# EAGLE schematic esd_fall_project rev3 (EAGLE 9.6.2)
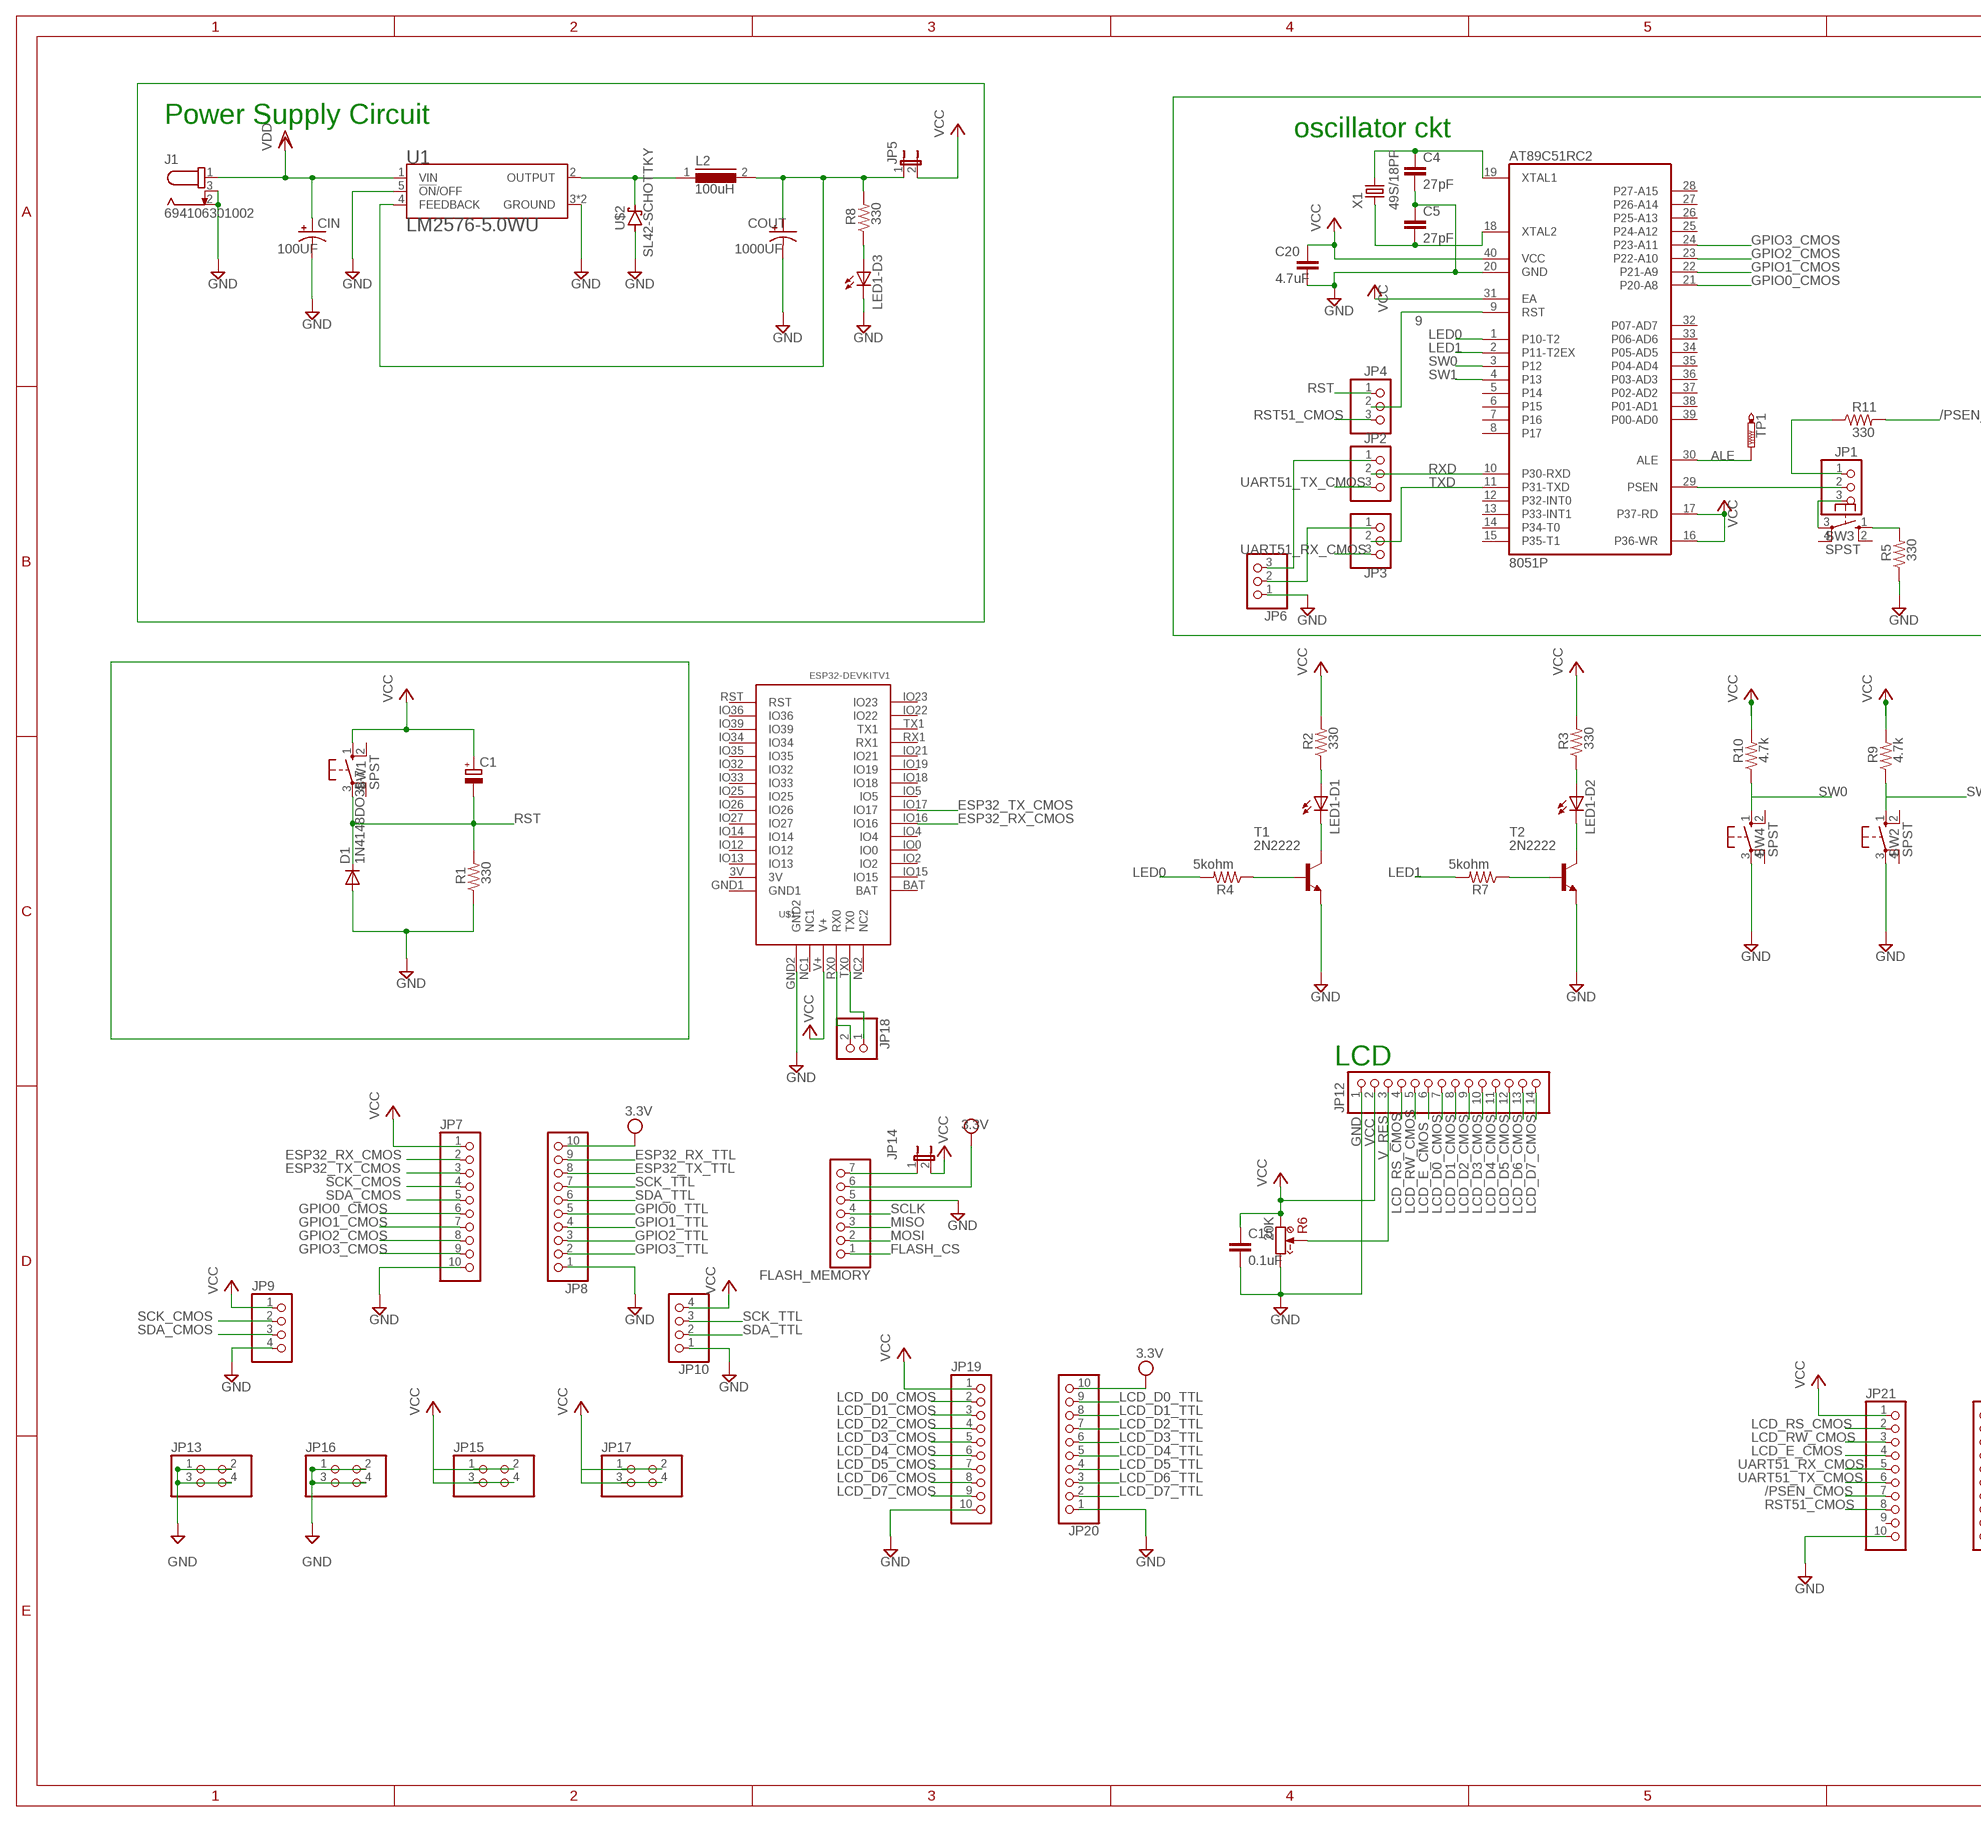
[diagram p0: schematic, sheet 1, part 1 of 2]
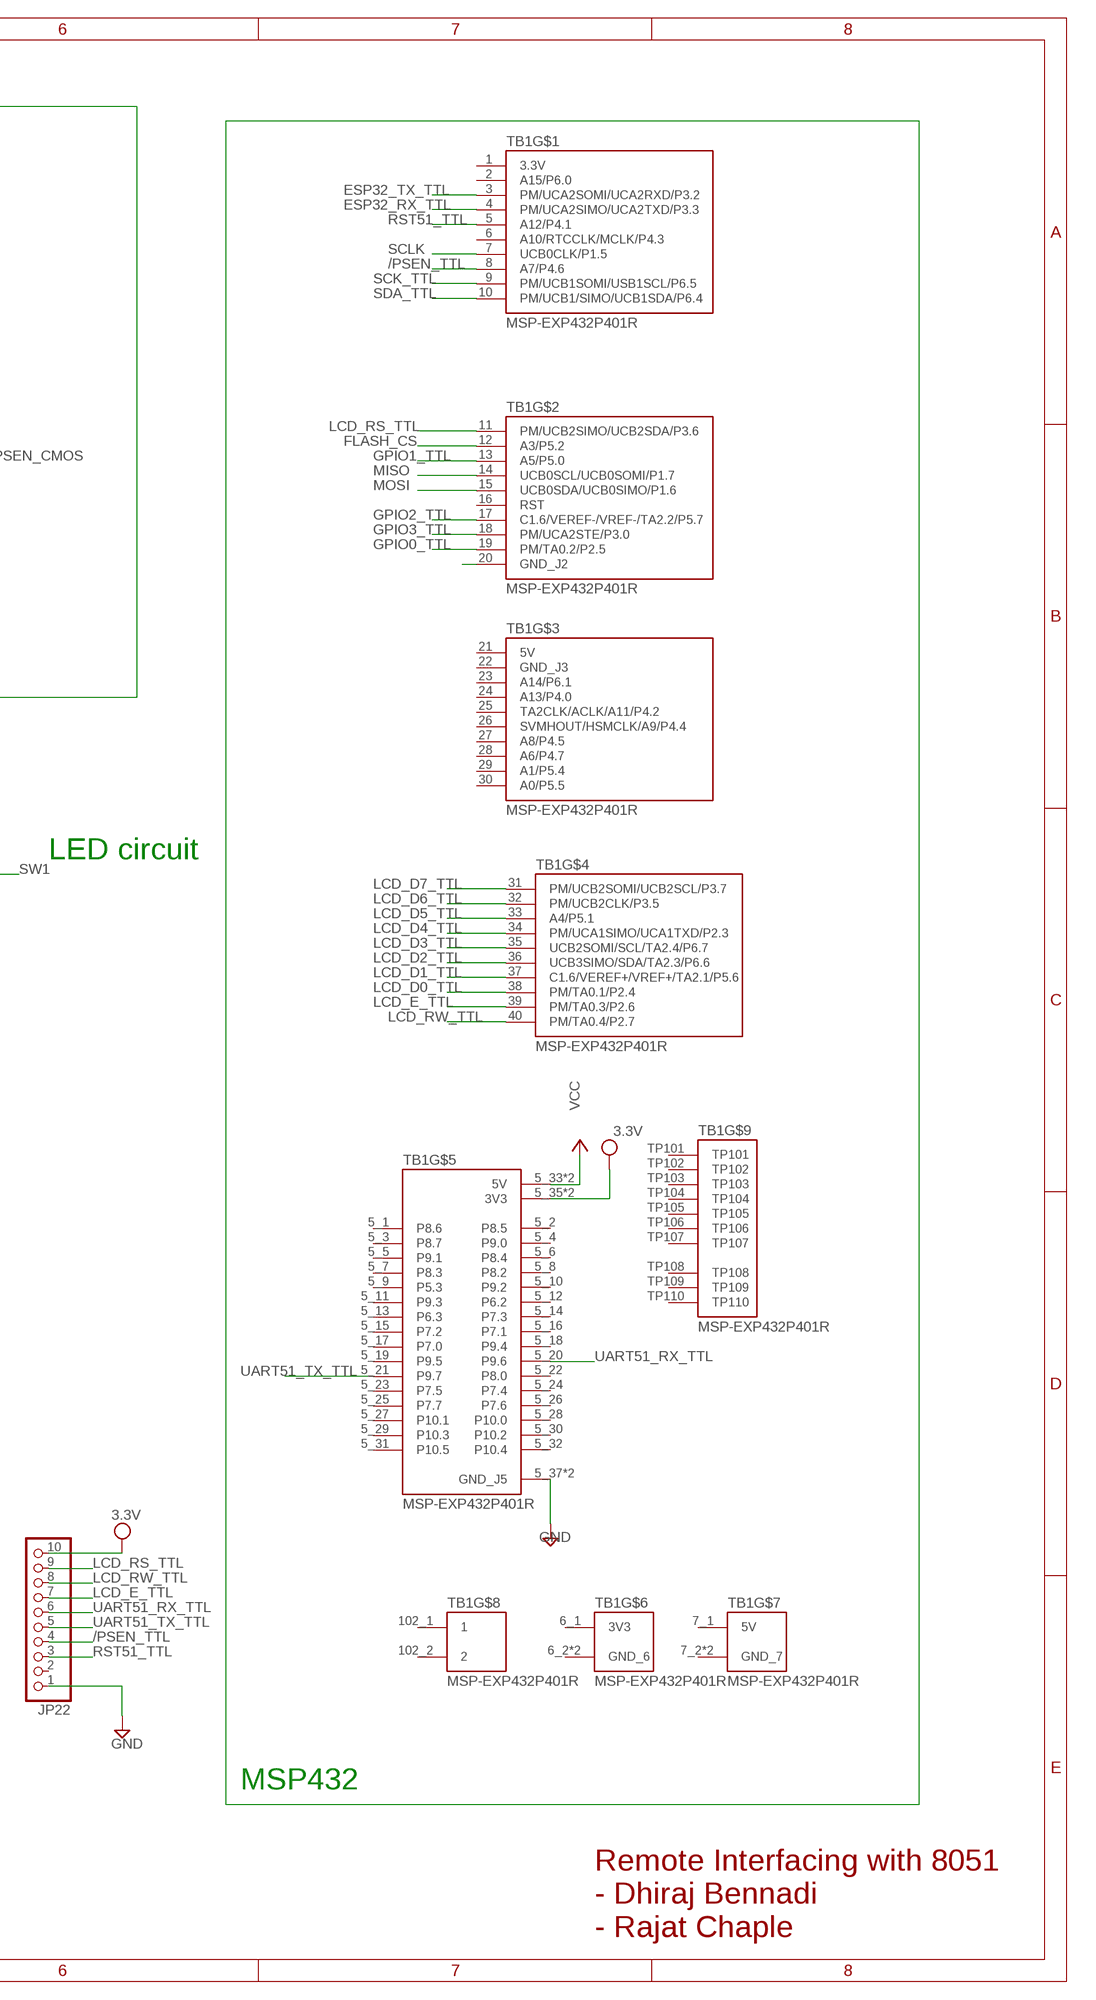
[diagram p1: schematic, sheet 1, part 2 of 2]

## Parts
AT89C51RC2  8051P  [DIL40]
C1  CPOL-EUE1.8-4  [E1,8-4]
C4  27pF  C2,5-3  [C2.5-3]
C5  27pF  C2,5-3  [C2.5-3]
C15  0.1uF  C2,5-3  [C2.5-3]
C20  4.7uF  C2,5-3  [C2.5-3]
CIN  100UF  [153CLV-1014]
COUT  1000UF  [150CLZ-1010]
D1  1N4148DO35-7  [DO35-7]
FLASH_MEMORY  PINHD-1X7  [1X07]
J1  694106301002  [694106301002]
JP1  PINHD-1X3  [1X03]
JP2  PINHD-1X3  [1X03]
JP3  PINHD-1X3  [1X03]
JP4  PINHD-1X3  [1X03]
JP5  JP1E  [JP1]
JP6  PINHD-1X3  [1X03]
JP7  PINHD-1X10  [1X10]
JP8  PINHD-1X10  [1X10]
JP9  PINHD-1X4  [1X04]
JP10  PINHD-1X4  [1X04]
JP12  PINHD-1X14  [1X14]
JP13  PINHD-2X2  [2X02]
JP14  JP1E  [JP1]
JP15  PINHD-2X2  [2X02]
JP16  PINHD-2X2  [2X02]
JP17  PINHD-2X2  [2X02]
JP18  PINHD-1X2  [1X02]
JP19  PINHD-1X10  [1X10]
JP20  PINHD-1X10  [1X10]
JP21  PINHD-1X10  [1X10]
JP22  PINHD-1X10  [1X10]
L2  100uH  DR127  [DR127]
LED1-D1  LED5MM  [LED5MM]
LED1-D2  LED5MM  [LED5MM]
LED1-D3  LED5MM  [LED5MM]
R1  330  R-US_0204/7  [0204/7]
R2  330  R-US_0204/7  [0204/7]
R3  330  R-US_0204/7  [0204/7]
R4  5kohm  R-US_0204/7  [0204/7]
R5  330  R-US_0204/7  [0204/7]
R6  20K  100K(64W/Y)  [64W]
R7  5kohm  R-US_0204/7  [0204/7]
R8  330  R-US_0204/7  [0204/7]
R9  4.7k  R-US_0204/7  [0204/7]
R10  4.7k  R-US_0204/7  [0204/7]
R11  330  R-US_0204/7  [0204/7]
SW1  SPST  10-XX  [B3F-10XX]
SW2  SPST  10-XX  [B3F-10XX]
SW3  SPST  10-XX  [B3F-10XX]
SW4  SPST  10-XX  [B3F-10XX]
T1  2N2222  [TO18]
T2  2N2222  [TO18]
TB1  MSP-EXP432P401R  [SHIELD_MSP-EXP432P401R]
TP1  PTR1B2,54  [B2,54]
U1  LM2576-5.0WU  [DPAK6P170_1524X459L254X81N]
U$1  ESP32DEVKITV1  [ESP32-DEVKITV1]
U$2  SL42-SCHOTTKY  [SMC]
X1  49S/18PF  [XTAL_HC49]

## Nets
3.3V: JP8.10 JP20.10 JP22.10
9: AT89C51RC2.9(RST) JP4.2
/PSEN_CMOS: JP21.7 R11.2
/PSEN_TTL: JP22.4 TB1.8(A7/P4.6)
ALE: AT89C51RC2.30(ALE) TP1.TP
ESP32_RX_CMOS: JP7.2 U$1.IO16
ESP32_RX_TTL: JP8.9 TB1.4(PM/UCA2SIMO/UCA2TXD/P3.3)
ESP32_TX_CMOS: JP7.3 U$1.IO17
ESP32_TX_TTL: JP8.8 TB1.3(PM/UCA2SOMI/UCA2RXD/P3.2)
FLASH_CS: FLASH_MEMORY.1 TB1.12(A3/P5.2)
GND: AT89C51RC2.20(GND) C4.2 C5.1 C15.2 C20.2 CIN.- COUT.- D1.A FLASH_MEMORY.5 J1.2 J1.3 JP6.1 JP7.10 JP8.1 JP9.4 JP10.1 JP12.1 JP13.1 JP13.2 JP13.3 JP13.4 JP16.1 JP16.2 JP16.3 JP16.4 JP19.10 JP20.1 JP21.10 JP22.1 LED1-D3.K(C) R1.1 R5.1 R6.3(CW) SW2.3(P) SW4.3(P) T1.1(E) T2.1(E) TB1.5_37(GND_J5) TB1.5_38(GND_J5) U1.3(GROUND) U1.5(!ON!/OFF) U1.6(GROUND) U$1.GND2 U$2.A
GPIO0_CMOS: AT89C51RC2.21(P20-A8) JP7.6
GPIO0_TTL: JP8.5 TB1.19(PM/TA0.2/P2.5)
GPIO1_CMOS: AT89C51RC2.22(P21-A9) JP7.7
GPIO1_TTL: JP8.4 TB1.13(A5/P5.0)
GPIO2_CMOS: AT89C51RC2.23(P22-A10) JP7.8
GPIO2_TTL: JP8.3 TB1.17(C1.6/VEREF-/VREF-/TA2.2/P5.7)
GPIO3_CMOS: AT89C51RC2.24(P23-A11) JP7.9
GPIO3_TTL: JP8.2 TB1.18(PM/UCA2STE/P3.0)
LCD_D0_CMOS: JP12.7 JP19.2
LCD_D0_TTL: JP20.9 TB1.38(PM/TA0.1/P2.4)
LCD_D1_CMOS: JP12.8 JP19.3
LCD_D1_TTL: JP20.8 TB1.37(C1.6/VEREF+/VREF+/TA2.1/P5.6)
LCD_D2_CMOS: JP12.9 JP19.4
LCD_D2_TTL: JP20.7 TB1.36(UCB3SIMO/SDA/TA2.3/P6.6)
LCD_D3_CMOS: JP12.10 JP19.5
LCD_D3_TTL: JP20.6 TB1.35(UCB2SOMI/SCL/TA2.4/P6.7)
LCD_D4_CMOS: JP12.11 JP19.6
LCD_D4_TTL: JP20.5 TB1.34(PM/UCA1SIMO/UCA1TXD/P2.3)
LCD_D5_CMOS: JP12.12 JP19.7
LCD_D5_TTL: JP20.4 TB1.33(A4/P5.1)
LCD_D6_CMOS: JP12.13 JP19.8
LCD_D6_TTL: JP20.3 TB1.32(PM/UCB2CLK/P3.5)
LCD_D7_CMOS: JP12.14 JP19.9
LCD_D7_TTL: JP20.2 TB1.31(PM/UCB2SOMI/UCB2SCL/P3.7)
LCD_E_CMOS: JP12.6 JP21.4
LCD_E_TTL: JP22.7 TB1.39(PM/TA0.3/P2.6)
LCD_RS_CMOS: JP12.4 JP21.2
LCD_RS_TTL: JP22.9 TB1.11(PM/UCB2SIMO/UCB2SDA/P3.6)
LCD_RW_CMOS: JP12.5 JP21.3
LCD_RW_TTL: JP22.8 TB1.40(PM/TA0.4/P2.7)
LED0: AT89C51RC2.1(P10-T2) R4.2
LED1: AT89C51RC2.2(P11-T2EX) R7.2
MISO: FLASH_MEMORY.3 TB1.14(UCB0SCL/UCB0SOMI/P1.7)
MOSI: FLASH_MEMORY.2 TB1.15(UCB0SDA/UCB0SIMO/P1.6)
N$1: R7.1 T2.2(B)
N$2: LED1-D2.A R3.1
N$3: COUT.+ JP5.1 L2.2 R8.2 U1.4(FEEDBACK)
N$4: L2.1 U1.2(OUTPUT) U$2.C
N$5: JP2.1 JP6.3
N$6: JP3.1 JP6.2
N$7: R4.1 T1.2(B)
N$8: AT89C51RC2.19(XTAL1) C4.1 X1.2
N$9: AT89C51RC2.18(XTAL2) C5.2 X1.1
N$10: LED1-D1.A R2.1
N$11: LED1-D3.A R8.1
N$13: AT89C51RC2.29(PSEN) JP1.2
N$14: JP18.2 U$1.RX0
N$15: LED1-D1.K(C) T1.3(C)
N$16: JP18.1 U$1.TX0
N$17: LED1-D2.K(C) T2.3(C)
N$18: FLASH_MEMORY.7 JP14.1
N$23: TB1.20(GND_J2)
N$35: R5.2 SW3.1(S)
N$36: JP1.3 SW3.3(P)
N$365: JP1.1 R11.1
RST: C1.- D1.C JP4.1 R1.2 SW1.3(P)
RST51_CMOS: JP4.3 JP21.8
RST51_TTL: JP22.3 TB1.5(A12/P4.1)
RXD: AT89C51RC2.10(P30-RXD) JP2.2
SCK_CMOS: JP7.4 JP9.2
SCK_TTL: JP8.7 JP10.3 TB1.9(PM/UCB1SOMI/USB1SCL/P6.5)
SCLK: FLASH_MEMORY.4 TB1.7(UCB0CLK/P1.5)
SDA_CMOS: JP7.5 JP9.3
SDA_TTL: JP8.6 JP10.2 TB1.10(PM/UCB1/SIMO/UCB1SDA/P6.4)
SW0: AT89C51RC2.3(P12) R10.1 SW4.1(S)
SW1: AT89C51RC2.4(P13) R9.1 SW2.1(S)
TXD: AT89C51RC2.11(P31-TXD) JP3.2
UART51_RX_CMOS: JP3.3 JP21.5
UART51_RX_TTL: JP22.6 TB1.5_20(P9.6)
UART51_TX_CMOS: JP2.3 JP21.6
UART51_TX_TTL: JP22.5 TB1.5_21(P9.7)
V_RES: JP12.3 R6.S(W) R6.S@1(W)
VCC: AT89C51RC2.16(P36-WR) AT89C51RC2.17(P37-RD) AT89C51RC2.31(EA) AT89C51RC2.40(VCC) C1.+ C15.1 C20.1 JP5.2 JP7.1 JP9.1 JP10.4 JP12.2 JP14.2 JP15.1 JP15.2 JP15.3 JP15.4 JP17.1 JP17.2 JP17.3 JP17.4 JP19.1 JP21.1 R2.2 R3.2 R6.1(CCW) R9.2 R10.2 SW1.1(S) TB1.5_33(5V) TB1.5_34(5V) U$1.V+
VDD: CIN.+ FLASH_MEMORY.6 J1.1 TB1.5_35(3V3) TB1.5_36(3V3) U1.1(VIN) ; supply symbol labelled 3.3V
Unconnected: AT89C51RC2.5(P14) AT89C51RC2.6(P15) AT89C51RC2.7(P16) AT89C51RC2.8(P17) AT89C51RC2.12(P32-INT0) AT89C51RC2.13(P33-INT1) AT89C51RC2.14(P34-T0) AT89C51RC2.15(P35-T1) AT89C51RC2.25(P24-A12) AT89C51RC2.26(P25-A13) AT89C51RC2.27(P26-A14) AT89C51RC2.28(P27-A15) AT89C51RC2.32(P07-AD7) AT89C51RC2.33(P06-AD6) AT89C51RC2.34(P05-AD5) AT89C51RC2.35(P04-AD4) AT89C51RC2.36(P03-AD3) AT89C51RC2.37(P02-AD2) AT89C51RC2.38(P01-AD1) AT89C51RC2.39(P00-AD0) JP21.9 JP22.2 SW1.2(S1) SW1.4(P1) SW2.2(S1) SW2.4(P1) SW3.2(S1) SW3.4(P1) SW4.2(S1) SW4.4(P1) TB1.1(3.3V) TB1.2(A15/P6.0) TB1.5_1(P8.6) TB1.5_2(P8.5) TB1.5_3(P8.7) TB1.5_4(P9.0) TB1.5_5(P9.1) TB1.5_6(P8.4) TB1.5_7(P8.3) TB1.5_8(P8.2) TB1.5_9(P5.3) TB1.5_10(P9.2) TB1.5_11(P9.3) TB1.5_12(P6.2) TB1.5_13(P6.3) TB1.5_14(P7.3) TB1.5_15(P7.2) TB1.5_16(P7.1) TB1.5_17(P7.0) TB1.5_18(P9.4) TB1.5_19(P9.5) TB1.5_22(P8.0) TB1.5_23(P7.5) TB1.5_24(P7.4) TB1.5_25(P7.7) TB1.5_26(P7.6) TB1.5_27(P10.1) TB1.5_28(P10.0) TB1.5_29(P10.3) TB1.5_30(P10.2) TB1.5_31(P10.5) TB1.5_32(P10.4) TB1.6(A10/RTCCLK/MCLK/P4.3) TB1.16(RST) TB1.23(A14/P6.1) TB1.24(A13/P4.0) TB1.25(TA2CLK/ACLK/A11/P4.2) TB1.26(SVMHOUT/HSMCLK/A9/P4.4) TB1.27(A8/P4.5) TB1.28(A6/P4.7) TB1.29(A1/P5.4) TB1.30(A0/P5.5) TB1.102_1 TB1.102_2 TB1.TP101 TB1.TP102 TB1.TP103 TB1.TP104 TB1.TP105 TB1.TP106 TB1.TP107 TB1.TP108 TB1.TP109 TB1.TP110 U$1.3V U$1.BAT U$1.GND1 U$1.IO0 U$1.IO2 U$1.IO4 U$1.IO5 U$1.IO12 U$1.IO13 U$1.IO14 U$1.IO15 U$1.IO18 U$1.IO19 U$1.IO21 U$1.IO22 U$1.IO23 U$1.IO25 U$1.IO26 U$1.IO27 U$1.IO32 U$1.IO33 U$1.IO34 U$1.IO35 U$1.IO36 U$1.IO39 U$1.NC1 U$1.NC2 U$1.RST U$1.RX1 U$1.TX1

## Notes on the sheet
- Power Supply Circuit
- oscillator ckt
- LED circuit
- LCD
- MSP432
- Remote Interfacing with 8051
  - Dhiraj Bennadi
  - Rajat Chaple

## Power pins joined to a net without a drawn wire
3V3: TB1.6_1(3V3)
5V: TB1.7_1(5V) TB1.21(5V)
GND_6: TB1.6_2(GND_6) TB1.6_3(GND_6)
GND_7: TB1.7_2(GND_7) TB1.7_3(GND_7)
GND_J3: TB1.22(GND_J3)

## Library data of the parts
AT89C51RC2 = micro-intel:8051: (CHMOS) SINGLE-CHIP 8-BIT MICROCONTROLLER 80C31BH / 80C51 BH / 87C51 MCS 51 Source: http://apps.intel.com .. 27041907.pdf; OC_FARNELL: unknown; OC_NEWARK: unknown
C1 = rcl:CPOL-EU: POLARIZED CAPACITOR, European symbol
C4 C5 C15 C20 = capacitor-wima:C: CAPACITOR naming: grid - package width
CIN = ESD_project:100UF
COUT = ESD_project:1000UF
D1 = diode:1N4148: DIODE high speed (Philips)
FLASH_MEMORY = pinhead:PINHD-1X7: PIN HEADER
J1 = DC Power Jacks:694106301002: CONN PWR JACK 2.1X5.5MM SOLDER Manufacturer's datasheet <https://katalog.we-online.de/em/datasheet/6941xx301002.pdf>; CREATED_BY: PCBLayout.com; DIGIKEY_PART_NUMBER: 732-5930-ND; MANUFACTURER: Wurth Electronics Inc.; MPN: 694106301002
JP1-JP4 JP6 = pinhead:PINHD-1X3: PIN HEADER
JP5 JP14 = jumper:JP1E: JUMPER
JP7 JP8 JP19-JP22 = pinhead:PINHD-1X10: PIN HEADER
JP9 JP10 = pinhead:PINHD-1X4: PIN HEADER
JP12 = pinhead:PINHD-1X14: PIN HEADER
JP13 JP15-JP17 = pinhead:PINHD-2X2: PIN HEADER
JP18 = pinhead:PINHD-1X2: PIN HEADER
L2 = inductors:DR127: High Power Density, High Efficiency, Shielded Inductors Source: coiltronics_dr_series.pdf
LED1-D1-LED1-D3 = led:LED: LED OSRAM: - CHIPLED LG R971, LG N971, LY N971, LG Q971, LY Q971, LO R971, LY R971 LH N974, LH R974 LS Q976, LO Q976, LY Q976 LO Q996 - Hyper CHIPLED LW Q18S LB Q993, LB Q99A, LB R99A - SideLED LS A670, LO A670, LY A670, LG A670, LP A670 LB A673, LV A673, LT A673, LW A673 LH A674 LY A675 LS A676, LA A676, LO A676, LY A676, LW A676 LS A679, LY A679, LG A679 - Hyper Micro SIDELED® LS Y876, LA Y876, LO Y876, LY Y876 LT Y87S - SmartLED LW L88C, LW L88S LB L89C, LB L89S, LG L890 LS L89K, LO L89K, LY L89K LS L896, LA L896, LO L896, LY L896 - TOPLED LS T670, LO T670, LY T670, LG T670, LP T670 LSG T670, LSP T670, LSY T670, LOP T670, LYG T670 LG T671, LOG T671, LSG T671 LB T673, LV T673, LT T673, LW T673 LH T674 LS T676, LA T676, LO T676, LY T676, LB T676, LH T676, LSB T676, LW T676 LB T67C, LV T67C, LT T67C, LS T67K, LO T67K, LY T67K, LW E67C LS E67B, LA E67B, LO E67B, LY E67B, LB E67C, LV E67C, LT E67C LW T67C LS T679, LY T679, LG T679 LS T770, LO T770, LY T770, LG T770, LP T770 LB T773, LV T773, LT T773, LW T773 LH T774 LS E675, LA E675, LY E675, LS T675 LS T776, LA T776, LO T776, LY T776, LB T776 LHGB T686 LT T68C, LB T68C - Hyper Mini TOPLED® LB M676 - Mini TOPLED Santana® LG M470 LS M47K, LO M47K, LY M47K Source: http://www.osram.convergy.de LUXEON: - LUMILED® LXK2-PW12-R00, LXK2-PW12-S00, LXK2-PW14-U00, LXK2-PW14-V00 LXK2-PM12-R00, LXK2-PM12-S00, LXK2-PM14-U00 LXK2-PE12-Q00, LXK2-PE12-R00, LXK2-PE12-S00, LXK2-PE14-T00, LXK2-PE14-U00 LXK2-PB12-K00, LXK2-PB12-L00, LXK2-PB12-M00, LXK2-PB14-N00, LXK2-PB14-P00, LXK2-PB14-Q00 LXK2-PR12-L00, LXK2-PR12-M00, LXK2-PR14-Q00, LXK2-PR14-R00 LXK2-PD12-Q00, LXK2-PD12-R00, LXK2-PD12-S00 LXK2-PH12-R00, LXK2-PH12-S00 LXK2-PL12-P00, LXK2-PL12-Q00, LXK2-PL12-R00 Source: www.luxeon.com KINGBRIGHT: KA-3528ASYC Source: www.kingbright.com
R1-R5 R7-R11 = rcl:R-US_: RESISTOR, American symbol
R6 = potentiometers:?(64W/Y)
SW1-SW4 = switch-omron:10-XX: OMRON SWITCH; MPN: B3F-1000; OC_FARNELL: 176432; OC_NEWARK: 36M3542
T1 T2 = transistor:2N2222: NPN TRANSISTOR
TB1 = msp432:MSP-EXP432P401R: SimpleLink™ MSP432P401R high-precision ADC LaunchPad™ Development Kit Check prices <https://pricing.snapeda.com/parts/MSP-EXP432P401R/Texas%20Instruments/view-part?ref=eda>; AVAILABILITY: In Stock; DESCRIPTION: SimpleLink™ MSP432P401R high-precision ADC LaunchPad™ Development Kit; MF: Texas Instruments; MP: MSP-EXP432P401R; PACKAGE: None; PRICE: None; PURCHASE-URL: https://pricing.snapeda.com/search/part/MSP-EXP432P401R/?ref=eda
TP1 = testpad:PTR1: TEST PIN
U1 = LM2576-5.0WU:LM2576-5.0WU: LM2576 Series 40 V 52 kHz 3 A Simple Step-Down Buck Regulator - TO-263-5 Check prices <https://pricing.snapeda.com/parts/LM2576-5.0WU-TR/Microchip/view-part?ref=eda>; AVAILABILITY: In Stock; DESCRIPTION: Buck Switching Regulator IC Positive Fixed 5V 1 Output 3A TO-263-6, D²Pak (5 Leads + Tab), TO-263BA; MF: Microchip; MP: LM2576-5.0WU-TR; PACKAGE: TO-263-5 Microchip; PRICE: None; PURCHASE-URL: https://pricing.snapeda.com/search/part/LM2576-5.0WU-TR/?ref=eda
U$1 = ESP32-DEVKITV1:ESP32DEVKITV1
U$2 = ESD_project:SL42-SCHOTTKY
X1 = Crystals_Oscillators:49S/18PF: Crystal Manufacturer's datasheet <https://datasheet.octopart.com/49S-18PF-Xinhunjing-datasheet-30677139.pdf>; CREATED_BY: PCBLayout.com; MANUFACTURER: Xinhunjing; MPN: 49S/18PF; PACKAGE: SMD

## Net classes
0 default: width 0.025 mm